# Altium schematic sheet tie-il-cfg.SchDoc: CS - Net Tie CFG
size Letter; CheckedBy: J. Brinton; CompanyName: Signal Laboratories, Inc.; DrawnBy: J. Brinton; Engineer: J. Brinton; Address1: 3479 Edison Way; Address2: Menlo Park CA 94025; Address3: +1 (877) 778-8435; Address4: siglabs.com; Revision: 3; SheetNumber: 21; SheetTotal: 47
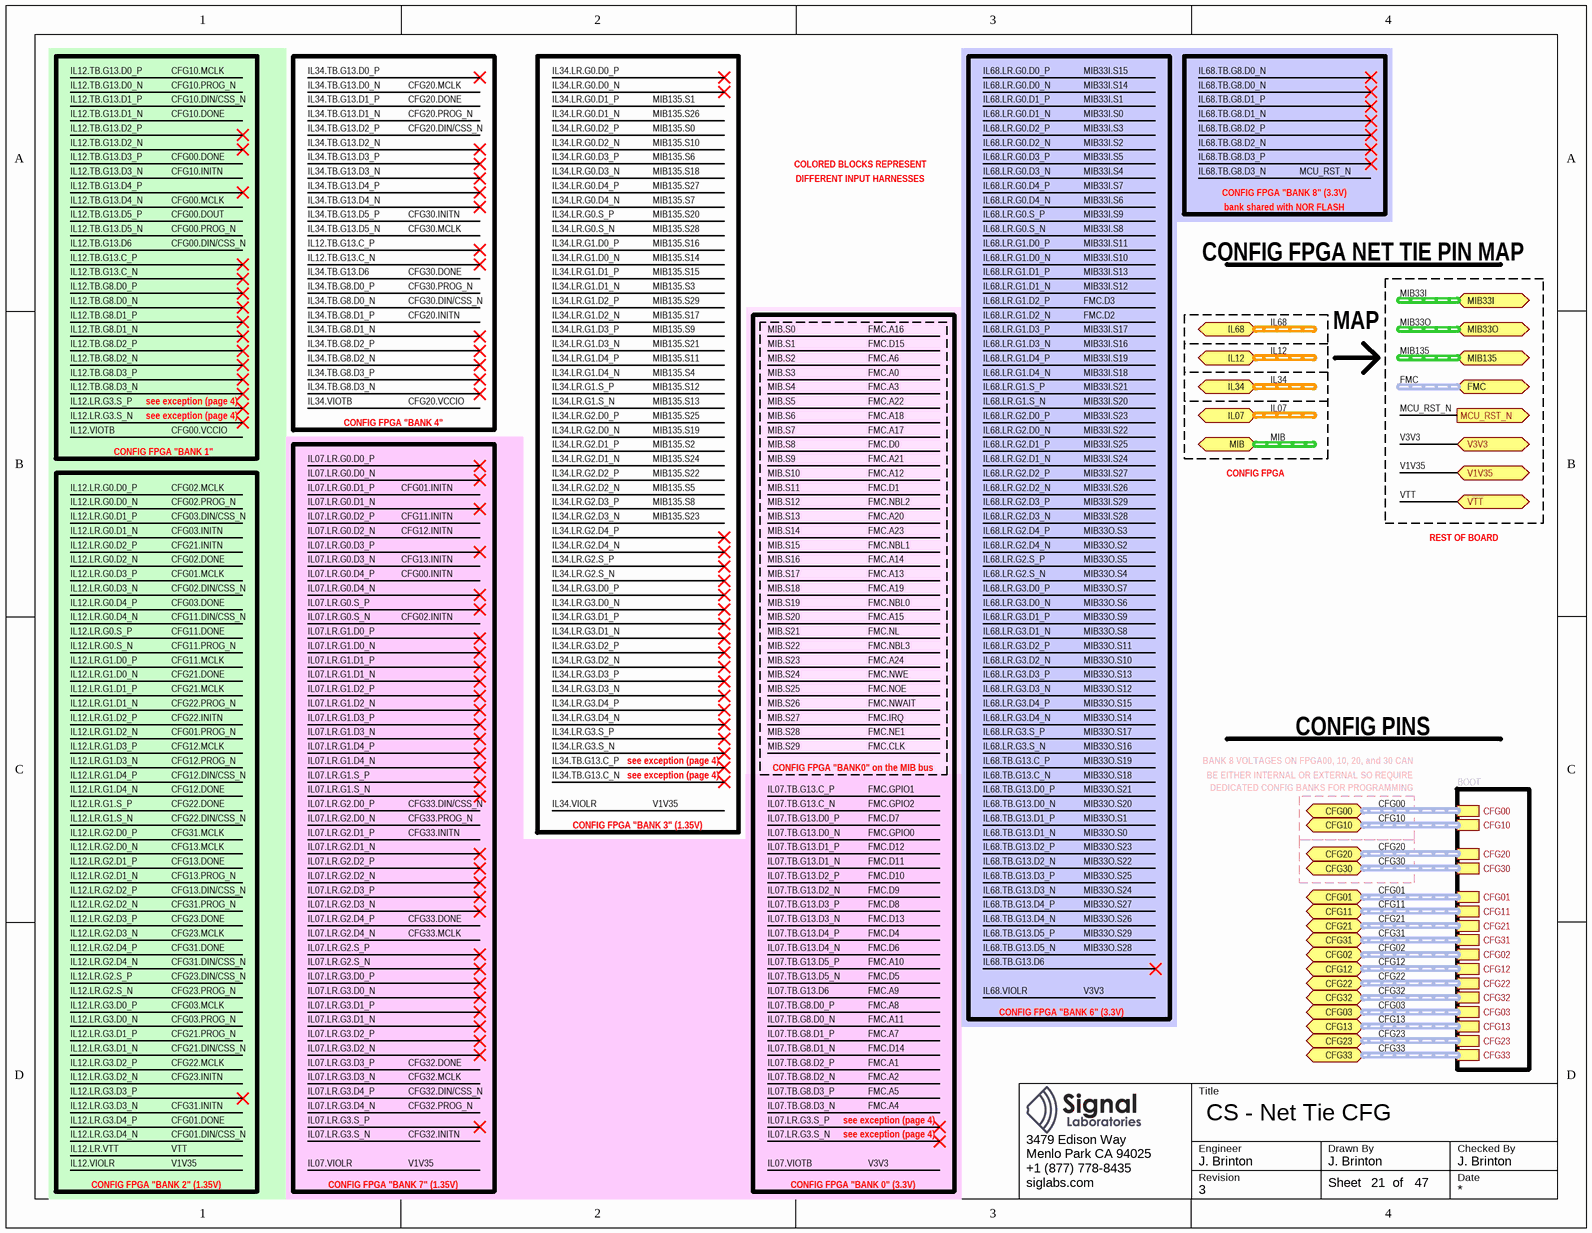
[diagram p0: tie-il-cfg.SchDoc]

## Sub-sheets
BOOT = config.SchDoc: CFG12 (harness CFG), CFG11 (harness CFG), CFG22 (harness CFG), CFG30 (harness CFG), CFG31 (harness CFG), CFG23 (harness CFG), CFG00 (harness CFG), CFG10 (harness CFG), CFG13 (harness CFG), CFG20 (harness CFG), CFG02 (harness CFG), CFG33 (harness CFG), CFG32 (harness CFG), CFG01 (harness CFG), CFG03 (harness CFG), CFG21 (harness CFG)

## Ports
CFG00 (harness CFG), CFG01 (harness CFG), CFG02 (harness CFG), CFG03 (harness CFG), CFG10 (harness CFG), CFG11 (harness CFG), CFG12 (harness CFG), CFG13 (harness CFG), CFG20 (harness CFG), CFG21 (harness CFG), CFG22 (harness CFG), CFG23 (harness CFG), CFG30 (harness CFG), CFG31 (harness CFG), CFG32 (harness CFG), CFG33 (harness CFG), FMC (harness FMC-3V3), IL07 (harness IL), IL12 (harness IL), IL34 (harness IL), IL68 (harness IL), MCU_RST_N (out), MIB33I (harness MIB), MIB33O (harness MIB), MIB135 (harness MIB), MIB (harness MIB), V1V35, V3V3, VTT

## Nets
IL07.VIOLR: port V1V35  [also labelled IL12.VIOLR, IL34.VIOLR, V1V35]
IL07.VIOTB: port V3V3  [also labelled IL68.VIOLR, V3V3]
IL12.LR.VTT: port VTT  [also labelled VTT]
IL68.TB.G8.D3_N: port MCU_RST_N  [also labelled MCU_RST_N]

## Buses and harness runs
harness CFG00 = port CFG00 = sheet BOOT/CFG00
harness CFG01 = port CFG01 = sheet BOOT/CFG01
harness CFG02 = port CFG02 = sheet BOOT/CFG02
harness CFG03 = port CFG03 = sheet BOOT/CFG03
harness CFG10 = port CFG10 = sheet BOOT/CFG10
harness CFG11 = port CFG11 = sheet BOOT/CFG11
harness CFG12 = port CFG12 = sheet BOOT/CFG12
harness CFG13 = port CFG13 = sheet BOOT/CFG13
harness CFG20 = port CFG20 = sheet BOOT/CFG20
harness CFG21 = port CFG21 = sheet BOOT/CFG21
harness CFG22 = port CFG22 = sheet BOOT/CFG22
harness CFG23 = port CFG23 = sheet BOOT/CFG23
harness CFG30 = port CFG30 = sheet BOOT/CFG30
harness CFG31 = port CFG31 = sheet BOOT/CFG31
harness CFG32 = port CFG32 = sheet BOOT/CFG32
harness CFG33 = port CFG33 = sheet BOOT/CFG33
harness FMC = port FMC
harness IL07 = port IL07
harness IL12 = port IL12
harness IL34 = port IL34
harness IL68 = port IL68
harness MIB33I = port MIB33I
harness MIB33O = port MIB33O
harness MIB135 = port MIB135
harness MIB = port MIB

## Notes on the sheet
- COLORED BLOCKS REPRESENT
- DIFFERENT INPUT HARNESSES
- CONFIG FPGA "BANK 8" (3.3V)
- bank shared with NOR FLASH
- CONFIG FPGA NET TIE PIN MAP
- see exception (page 4)
- MAP
- CONFIG FPGA "BANK 1"
- CONFIG FPGA "BANK 4"
- CONFIG FPGA
- REST OF BOARD
- CONFIG PINS
- CONFIG FPGA "BANK 3" (1.35V)
- CONFIG FPGA "BANK0" on the MIB bus
- BE EITHER INTERNAL OR EXTERNAL SO REQUIRE
- DEDICATED CONFIG BANKS FOR PROGRAMMING
- BANK 8 VOLTAGES ON FPGA00, 10, 20, and 30 CAN
- CONFIG FPGA "BANK 6" (3.3V)
- CONFIG FPGA "BANK 2" (1.35V)
- CONFIG FPGA "BANK 7" (1.35V)
- CONFIG FPGA "BANK 0" (3.3V)
- Title
- Engineer
- Revision
- Drawn By
- Checked By
- Date
- Sheet
- of